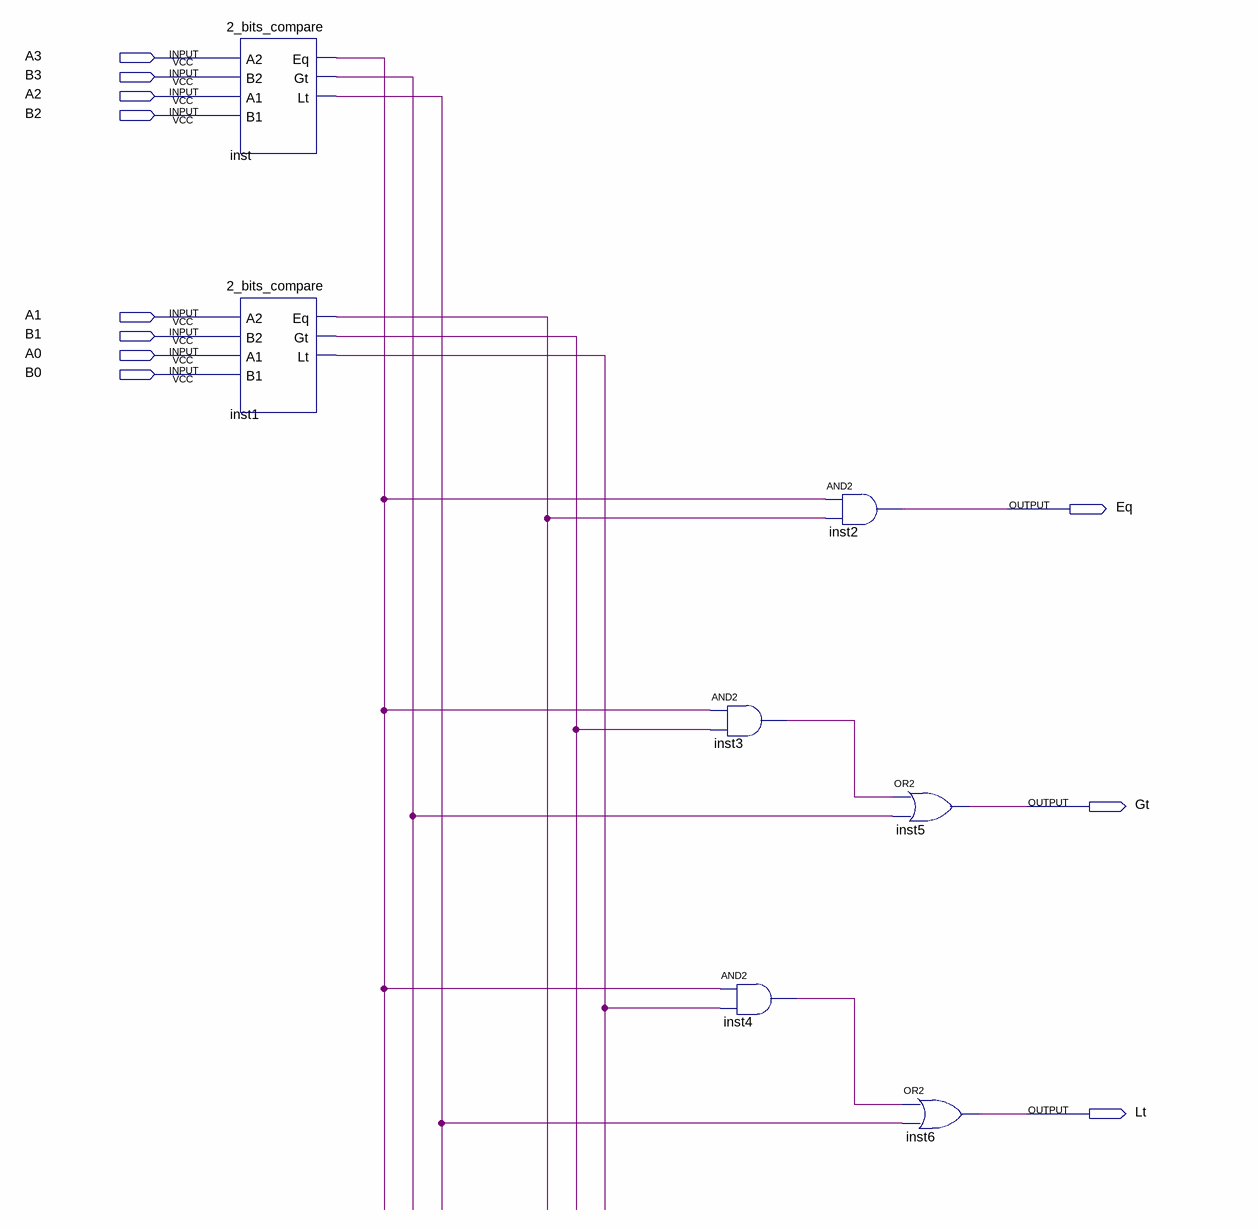
[diagram p0: schematic sheet]
// Quartus schematic 4_bits_compare.bdf as structural Verilog: 7 symbols, 11 pins
module \4_bits_compare  (
  input  A3,
  input  B3,
  input  A2,
  input  B2,
  input  A1,
  input  B1,
  input  A0,
  input  B0,
  output Eq,
  output Gt,
  output Lt
);

  wire inst1_eq, inst1_gt, inst1_lt, inst3_out, inst4_out, inst_eq, inst_gt, inst_lt;

  \2_bits_compare  inst (.A2(A3), .B2(B3), .A1(A2), .B1(B2), .Eq(inst_eq), .Gt(inst_gt), .Lt(inst_lt));
  \2_bits_compare  inst1 (.A2(A1), .B2(B1), .A1(A0), .B1(B0), .Eq(inst1_eq), .Gt(inst1_gt), .Lt(inst1_lt));
  and inst3 (inst3_out, inst_eq, inst1_gt);
  and inst4 (inst4_out, inst_eq, inst1_lt);
  and inst2 (Eq, inst_eq, inst1_eq);
  or inst5 (Gt, inst3_out, inst_gt);
  or inst6 (Lt, inst4_out, inst_lt);
endmodule
